# EAGLE design Adafruit HDC3021 Precision Temperature & Humidity Sensor (EAGLE 9.6.2)
COMPANY: ADAFRUIT INDUSTRIES; DRAWN: KTOWN; REV: A
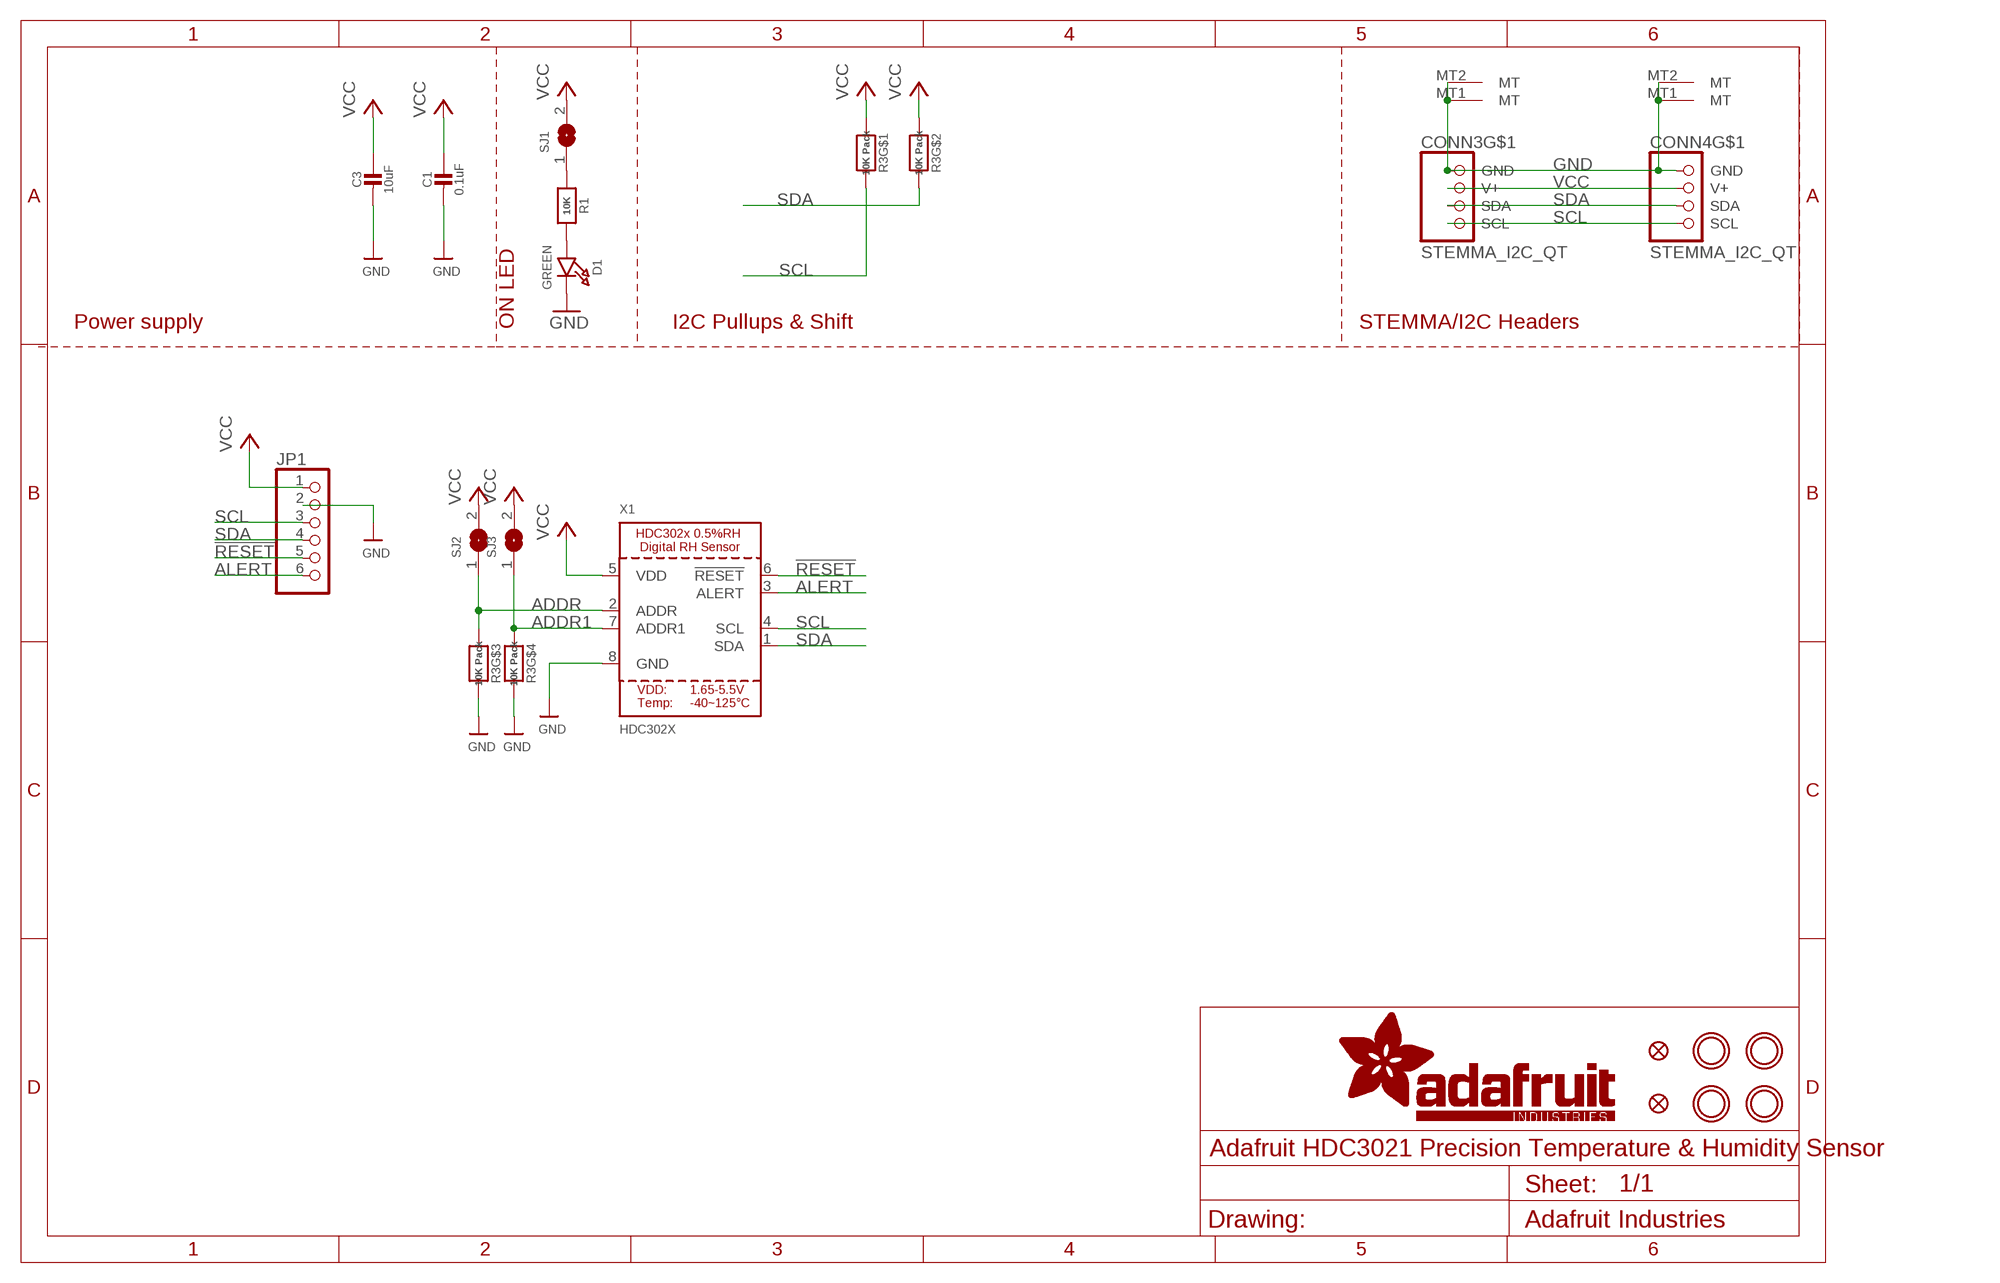
[diagram p0: schematic, sheet 1]

## Parts
C1  0.1uF  CAP_CERAMIC0603_NO  [0603-NO]
C3  10uF  CAP_CERAMIC0805-NOOUTLINE  [0805-NO]
CONN3  STEMMA_I2C_QT  [JST_SH4]
CONN4  STEMMA_I2C_QT  [JST_SH4]
D1  GREEN  LED0603_NOOUTLINE  [CHIPLED_0603_NOOUTLINE]
FID3  FIDUCIAL_1MM  [FIDUCIAL_1MM]
FID4  FIDUCIAL_1MM  [FIDUCIAL_1MM]
JP1  HEADER-1X670MIL  [1X06_ROUND_70]
R1  10K  RESISTOR_0603_NOOUT  [0603-NO]
R3  10K Pack  RESISTOR_4PACK  [RESPACK_4X0603]
SJ1  SOLDERJUMPERCLOSED  [SOLDERJUMPER_CLOSEDWIRE]
SJ2  SOLDERJUMPER  [SOLDERJUMPER_ARROW_NOPASTE]
SJ3  SOLDERJUMPER  [SOLDERJUMPER_ARROW_NOPASTE]
U$1  MOUNTINGHOLE2.5  [MOUNTINGHOLE_2.5_PLATED]
U$17  MOUNTINGHOLE2.5  [MOUNTINGHOLE_2.5_PLATED]
U$19  MOUNTINGHOLE2.5  [MOUNTINGHOLE_2.5_PLATED]
U$21  MOUNTINGHOLE2.5  [MOUNTINGHOLE_2.5_PLATED]
X1  HDC302X  [WSON8]

## Nets
!RESET: JP1.5 X1.6(!RESET)
ADDR: R3.3 SJ2.1 X1.2(ADDR)
ADDR1: R3.4 SJ3.1 X1.7(ADDR1)
ALERT: JP1.6 X1.3(ALERT)
GND [highpower]: C1.2 C3.2 CONN3.1(GND) CONN3.MT1(MT) CONN3.MT2(MT) CONN4.1(GND) CONN4.MT1(MT) CONN4.MT2(MT) D1.C JP1.2 R3.5 R3.6 X1.8(GND)
N$1: D1.A R1.2
N$2 [lowpower]: R1.1 SJ1.1
SCL: CONN3.4(SCL) CONN4.4(SCL) JP1.3 R3.8 X1.4(SCL)
SDA: CONN3.3(SDA) CONN4.3(SDA) JP1.4 R3.7 X1.1(SDA)
VCC [highpower]: C1.1 C3.1 CONN3.2(V+) CONN4.2(V+) JP1.1 R3.1 R3.2 SJ1.2 SJ2.2 SJ3.2 X1.5(VDD)

## Notes on the sheet
- Power supply | ON LED | I2C Pullups & Shift | STEMMA/I2C Headers

## Library data of the parts
C1 C3 = microbuilder:CAP_CERAMIC: Ceramic Capacitors For new designs, use the packages preceded by an '_' character since they are more reliable: The following footprints should be used on most boards: _0402 - Standard footprint for regular board layouts _0603 - Standard footprint for regular board layouts _0805 - Standard footprint for regular board layouts _1206 - Standard footprint for regular board layouts For extremely tight-pitch boards where space is at a premium, the following 'micro-pitch' footprints can be used (smaller pads, no silkscreen outline, etc.): _0402MP - Micro-pitch footprint for very dense/compact boards _0603MP - Micro-pitch footprint for very dense/compact boards _0805MP - Micro-pitch footprint for very dense/compact boards _1206MP - Micro-pitch footprint for very dense/compact boards
CONN3 CONN4 = adafruit_electromech:STEMMA_I2C; LCSC: C2845363
D1 = microbuilder:LED: LED 0603 - 0603 Surface Mount Package 2mA: Green LED - Low Power (3.9mcd, 2ma, 1.7Vf) - Digikey: 475-2709-2-ND Orange LED - Low Power (9.8mcd, 2ma, 1.8Vf) - Digikey: 475-1194-2-ND Red LED - Low Power (5mcd, 2ma, 1.8Vf) - Digikey: 475-1195-2-ND Yellow LED - Low Power (7mcd, 2ma, 1.8Vf) - Digikey: 475-1196-2-ND 5mA: Blue LED - Low Power (17mcd, 5ma, 2.9Vf) - Digikey: LNJ937W8CRACT-ND 0805 - 0805 Surface Mount Package 2mA: Red LED (8.8mcd, 2mA, 1.8Vf, Clear) - Low Power [Digikey: 475-2510-1-ND] Green LED (5mcd, 2mA, 1.8Vf, Clear) - Low Power [Digikey: 475-2730-1-ND] Yellow LED (11.3mcd, 2mA, 1.8Vf, Clear) - Low Power [Digikey: 475-2555-1-ND] 20mA: Red LED (104mcd, 20mA, Diffused) - LS R976 [Digikey: 475-1278-6-ND] Red LED (12mcd, 20mA, 2.0Vf, Clear) - APT2012EC [Digikey: 754-1128-1-ND] Green LED (15mcd, 20mA, 2.2Vf, Clear) - APT2012GC [Digikey: 754-1131-1-ND] Orange LED (160mcd, 20mA, 2.1Vf, Clear) - APT2012SECK [Digikey: 754-1130-1-ND] 1206 - 1206 Surface Mount Package Green LED (26mcd, 20mA, Diffused) - LG N971 [Digikey: 475-1407-6-ND] Red LED (15mcd, 20mA, Diffused) - LH N974 [Digikey: 475-1416-6-ND] Cree - Cree High-Power Surface Mount LEDs XPEBWT-L1-0000-00D50 - White 111lm 350mA 2.9Vf 6200K 110° XTEAWT-00-0000-00000LEE3 - White 114lm 350mA 2.85Vf 5000K 115° Everlight - Everlight 45-21 Series Surface Mount LEDs 45-21/QK2C-B2832AC2CB2/2T - Warm White 2000mcd 20mA 3.25Vf 3050K 120° 45-21/LK2C-B38452C4CB2/2T - Nuetral White 2000mcd 20mA 3.25Vf 4150K 120° 45-21/LK2C-B50634C6CB2/2T - Cold White 2200mcd 20mA 3.25Vf 5650K 120° PLCC2 Reverse Mount LS T77K-J1L2-1-0-2-R18-Z - Red 11.25mcd 2mA 1.8Vf 630nm 120° LO T77K-L1M2-24-Z - Orange 19.6mcd 2mA 1.8Vf 606nm 120° LY T77K-K2M1-26-Z - Yellow 15.7mcd 2mA 1.8Vf 587nm 120°; JLC_ROTATION: 270
FID3 FID4 = microbuilder:FIDUCIAL: Fiducial Alignment Points Various fiducial points for machine vision alignment.; BOM: EXCLUDE
JP1 = microbuilder:HEADER-1X6: PIN HEADER
R1 = microbuilder:RESISTOR: Resistors For new designs, use the packages preceded by an '_' character since they are more reliable: The following footprints should be used on most boards: _0402 - Standard footprint for regular board layouts _0603 - Standard footprint for regular board layouts _0805 - Standard footprint for regular board layouts _1206 - Standard footprint for regular board layouts For extremely tight-pitch boards where space is at a premium, the following 'micro-pitch' footprints can be used (smaller pads, no silkscreen outline, etc.): _0402MP - Micro-pitch footprint for very dense/compact boards _0603MP - Micro-pitch footprint for very dense/compact boards _0805MP - Micro-pitch footprint for very dense/compact boards _1206MP - Micro-pitch footprint for very dense/compact boards
R3 = microbuilder:RESISTOR_4PACK: Resistor Packs (4 resistors) 4 x 0603 10K 1/16W - Digikey: YC164J-10KCT-ND
SJ1 = microbuilder:SOLDERJUMPER: SMD Solder JUMPER Solder the two pads together to create a connection, or remove the solder to break it. REFLOW - Use this footprint for solder paste and reflow ovens. WAVE - Use this footprint for hand-soldering (larger pads). CLOSED - Has a trace between the two pads to ensure it is closed by default. The trace needs to be cut to disable the jumper, and can be closed again by creating a solder bridge between the two pads.
SJ2 SJ3 = microbuilder:SOLDERJUMPER: SMD Solder JUMPER Solder the two pads together to create a connection, or remove the solder to break it. REFLOW - Use this footprint for solder paste and reflow ovens. WAVE - Use this footprint for hand-soldering (larger pads). CLOSED - Has a trace between the two pads to ensure it is closed by default. The trace needs to be cut to disable the jumper, and can be closed again by creating a solder bridge between the two pads.; BOM: EXCLUDE
U$1 U$17 U$19 U$21 = adafruit_electromech:MOUNTINGHOLE: Mounting Hole For #2 screws (0.086"/2.18mm width, 0.094"/2.4mm hole) use 2.5mm; BOM: EXCLUDE
X1 = adafruit_sensor:HDC302X

## Net classes
1 highpower: width 0.305 mm, drill 0.483 mm
2 lowpower: width 0.254 mm, drill 0.483 mm

## Board
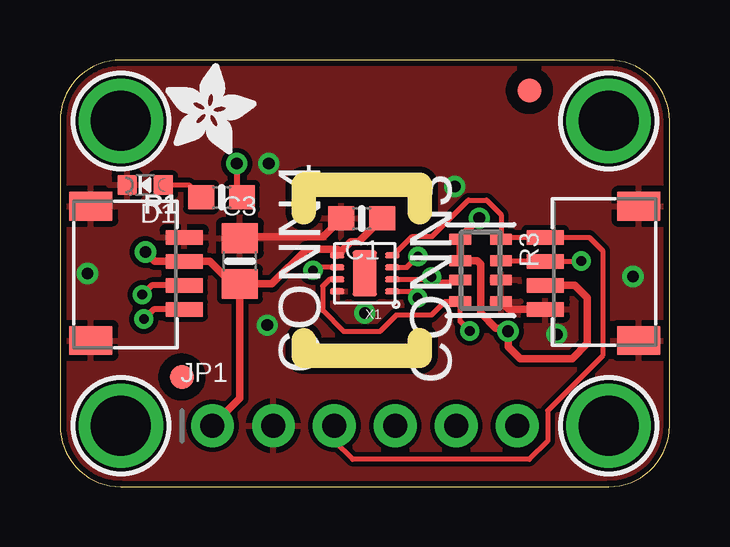
[diagram p1: board, top side]
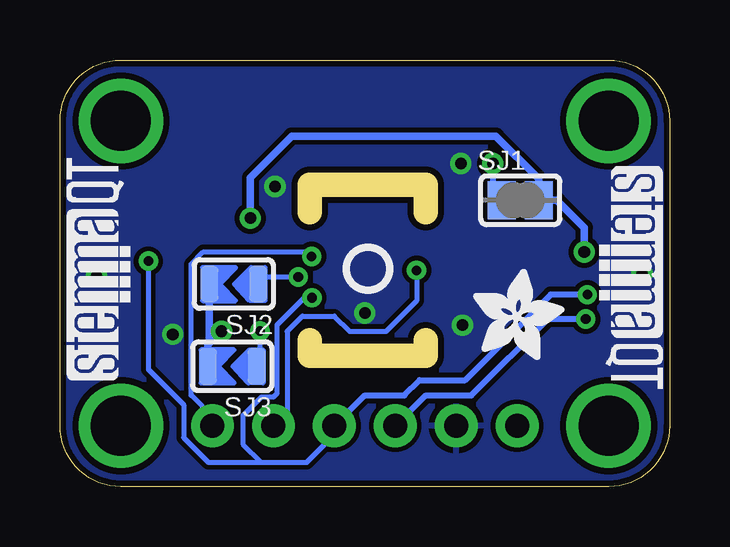
[diagram p2: board, bottom side, seen from below]

Size 25.4 x 17.78 mm. Coordinates in mm from the lower left corner, seen from the top.
Outline: 10.16,11.43 10.16,12.57 14.99,12.57 14.99,11.43
Outline: 10.16,6.1 10.16,5.46 14.99,5.46 14.99,6.1
Outline: 0,15.24 0,2.54 arc90 2.54,0 22.86,0 arc90 25.4,2.54 25.4,15.24 arc90 22.86,17.78 2.54,17.78 arc90 0,15.24
Copper layers (1*16): Top 0.035mm / dielectric 1.5mm / Bottom 0.035mm
Design rules "adafruit *": minimum track width 8mil, minimum drill 15.5mil, track to track 8mil, track to pad 8mil, pad to pad 8mil, via to via 8mil, smd to smd 8mil, copper to edge 10mil, drill to drill 8mil, minimum pad ring 10mil, minimum via ring 8mil, stop-mask expansion 2mil, vias tented up to drill 20mil, thermal gap 10mil

### Footprints (pad centres in the part's own frame; a part is rotated, then mirrored left to right if it is on the bottom)
0603-NO = smd 1.075 x 1: 1 -0.85,0; 2 0.85,0
0805-NO = smd 1.24 x 1.5: 1 -0.95,0; 2 0.95,0
JST_SH4 = smd 0.6 x 1.55: 1 -1.5,2.006; 2 -0.5,2.006; 3 0.5,2.006; 4 1.5,2.006 | smd 1.2 x 1.8: MT1 -2.8,-1.894; MT2 2.8,-1.894
CHIPLED_0603_NOOUTLINE = smd 0.8 x 0.8: A 0,-0.75; C 0,0.75
FIDUCIAL_1MM = smd 1 x 1: 1 0,0
1X06_ROUND_70 = drill 1 pad 1.778: 1 -6.35,0; 2 -3.81,0; 3 -1.27,0; 4 1.27,0; 5 3.81,0; 6 6.35,0
RESPACK_4X0603 = smd 0.45 x 0.9: 1 -1.3,-0.85; 2 -0.4,-0.85; 3 0.4,-0.85; 4 1.3,-0.85; 5 1.3,0.85; 6 0.4,0.85; 7 -0.4,0.85; 8 -1.3,0.85
SOLDERJUMPER_CLOSEDWIRE = smd 1.168 x 1.6: 1 -0.762,0; 2 0.762,0 | smd 0.635 x 0.203: WIRE 0,0
SOLDERJUMPER_ARROW_NOPASTE = smd 0.762 x 1.524: 1 -1.016,0; 2 1.016,0
MOUNTINGHOLE_2.5_PLATED = drill 2.5 pad 3.2: P$1 0,0
WSON8 = smd 0.6 x 0.25: 1 -1.15,0.75; 2 -1.15,0.25; 3 -1.15,-0.25; 4 -1.15,-0.75; 5 1.15,-0.75; 6 1.15,-0.25; 7 1.15,0.25; 8 1.15,0.75 | smd 1 x 1.9: PAD 0,0

### Placement (x,y rotation side)
C1  12.57,11.18 180 top
C3  7.49,9.4 90 top
CONN3  22.23,8.89 90 top
CONN4  3.17,8.89 270 top
D1  3.56,12.57 90 top
FID3  5.08,4.57 0 top
FID4  19.56,16.51 0 top
JP1  12.7,2.54 0 top
PLABEL0  [PLABEL0]  6.35,0.89 0 top
PLABEL1  [PLABEL1]  8.89,4.19 0 top
PLABEL2  [PLABEL2]  11.43,0.89 0 top
PLABEL3  [PLABEL3]  13.97,4.19 0 top
PLABEL4  [PLABEL4]  16.64,0.89 0 top
PLABEL5  [PLABEL5]  19.05,4.19 0 top
PLABEL6  [PLABEL6]  13.34,16.13 0 top
PLABEL7  [PLABEL7]  14.1,14.22 0 top
PLABEL8  [PLABEL8]  0.38,12.45 0 top
PLABEL9  [PLABEL9]  12.7,0.89 0 bottom
PLABEL10  [PLABEL10]  6.16,10.1 0 bottom
PLABEL11  [PLABEL11]  20.64,8.57 90 bottom
PLABEL12  [PLABEL12]  20.64,5.02 90 bottom
PLABEL13  [PLABEL13]  12.7,16.26 0 bottom
PLABEL14  [PLABEL14]  10.16,4.19 0 bottom
PLABEL15  [PLABEL15]  12.7,14.29 0 bottom
R1  6.73,12.06 180 top
R3  17.53,9.02 270 top
SJ1  6.22,11.94 0 bottom
SJ2  18.16,8.45 180 bottom
SJ3  18.22,5.02 180 bottom
U$1  2.54,15.24 0 top
U$7  [ADAFRUIT_3.5MM]  8.19,5.27 0 bottom
U$17  22.86,15.24 0 top
U$19  2.54,2.54 0 top
U$21  22.86,2.54 0 top
U$22  [ADAFRUIT_3.5MM]  4.38,13.84 0 top
U$25  [PCBFEAT-REV-040]  12.57,9.08 0 bottom
U$30  [STEMMAQT]  22.48,4.45 90 bottom
U$31  [STEMMAQT]  2.92,13.34 270 bottom
X1  12.7,8.89 180 top

### Tracks (layer width: path | path; a pad name or v marks a point on that pad's centre or on a via)
!RESET  (via drill 0.4)
  Top 0.203: X1.6 10.66,9.14 v10.54,9.02
  Bottom 0.203: v10.54,9.02 10.54,7.75 11.81,6.48 13.34,6.48 13.97,7.11 15.3,7.11 15.94,6.48 15.94,3.11 JP1.5
ADDR  (via drill 0.4)
  Top 0.203: R3.3 16.57,8.51 15.37,8.51 15.25,8.64 | X1.2 15.25,8.64 | 15.25,8.64 15.38,8.64 v15.47,8.73
  Bottom 0.203: v15.47,8.73 16.86,8.73 SJ2.1
ADDR1  (via drill 0.4)
  Top 0.203: X1.7 11.23,8.64 10.95,8.36 10.95,7.34 11.81,6.48 13.34,6.48 14,7.15 15.47,7.15 16.04,7.72 R3.4 16.68,6.89 v17.07,6.49
  Bottom 0.203: SJ3.1 17.07,5.15 v17.07,6.49
ALERT  (via drill 0.4)
  Top 0.203: X1.3 14.46,9.14 v14.91,9.6
  Bottom 0.203: JP1.6 19.05,2.92 19.94,3.81 19.94,9.27 19.42,9.79 15.1,9.79 v14.91,9.6
GND  (via drill 0.48)
  Top 0.305: C1.2 10.96,10.41 7.56,10.41 C3.2 | CONN3.1 18.7,7.39 R3.5
  other vias: 12.7,7.24 23.88,8.76 1.14,8.89 8.7,13.46 16.45,12.51 8.64,6.73 20.7,6.35
  pour Top: 0,17.78 25.4,17.78 25.4,0 0,0
  pour Bottom: 0,17.78 25.4,17.78 25.4,0 0,0
N$1
  Top 0.203: D1.A 5.37,12.57 R1.2
N$2  (via drill 0.48)
  Top 0.254: v7.37,13.46 7.37,12.28 R1.1
  Bottom 0.254: v7.37,13.46 7.37,12.32 SJ1.1
SCL  (via drill 0.4)
  Top 0.203: JP1.3 11.43,1.91 12.19,1.14 19.56,1.14 20.32,1.91 20.32,3.17 22.61,5.46 22.61,9.84 22.06,10.39 CONN3.4 18.45,10.39 R3.8 18.38,11.34 17.78,11.94 17.02,11.94 15.51,10.43 14.68,10.43 13.89,9.64 X1.4
  Top 0.254: CONN4.4 3.9,7.39 v3.49,6.99
  Bottom 0.254: v3.49,6.99 5.08,6.99 8.26,3.81 10.16,3.81 JP1.3
SDA  (via drill 0.4)
  Top 0.203: R3.7 20.19,9.42 CONN3.3 21.71,9.39 v21.72,9.4 | X1.1 14.64,8.14 v14.9,7.87
  Top 0.254: CONN4.3 3.82,8.39 v3.43,8
  Bottom 0.203: 17.02,1.02 17.78,1.78 17.78,2.99 17.74,2.99 17,3.73 16.51,3.73 16.36,3.88 16.36,6.73 15.22,7.87 v14.9,7.87 | 17.02,1.02 15.11,1.02 13.97,2.16 JP1.4 | v21.72,9.4 21.72,4.89 20.24,3.42 20.24,2.05 19.21,1.02 17.02,1.02
  Bottom 0.254: v3.43,8 4.95,8 8.51,4.45 10.41,4.45 11.05,3.81 12.7,3.81 JP1.4
VCC  (via drill 0.48)
  Top 0.305: C3.1 7.49,3.68 JP1.1 | C3.1 7.17,8.45 6.23,9.39 CONN4.2 3.94,9.39 v3.56,9.78 | C3.1 8.83,8.45 10.28,9.89 11.55,9.89 X1.5 12.11,10.2 12.45,10.2 C1.1 | CONN3.2 21.45,8.39 21.97,7.87 21.97,5.97 21.34,5.33 19.18,5.33 18.67,5.84 v18.67,6.48 18.54,6.6 18.16,6.6 17.53,7.24 17.53,9.27 17.38,9.42 R3.2 R3.1 16.68,10.39 v17.47,11.19
  Bottom 0.305: v3.56,9.78 3.56,10.79 4.7,11.94 SJ1.2 5.46,12.83 7.24,14.61 15.75,14.61 17.47,12.88 v17.47,11.19 | SJ2.2 19.18,5.97 | SJ3.2 19.24,5.91 19.18,5.97 | 19.18,5.97 v18.67,6.48

### Text on the board
Pinguin_tBackup: HDC302x | Precision Temp+RH | on | GND | SDA | ALERT | VIN | SCL | RST
Pinguin_bBackup: HDC302x | Temp & Humid Sensor | LED | A0 | A1 | Def I2C addr 0x44 | VLogic/Vcc: 3-5VDC